# Altium project girassol-projeto.PrjPCB
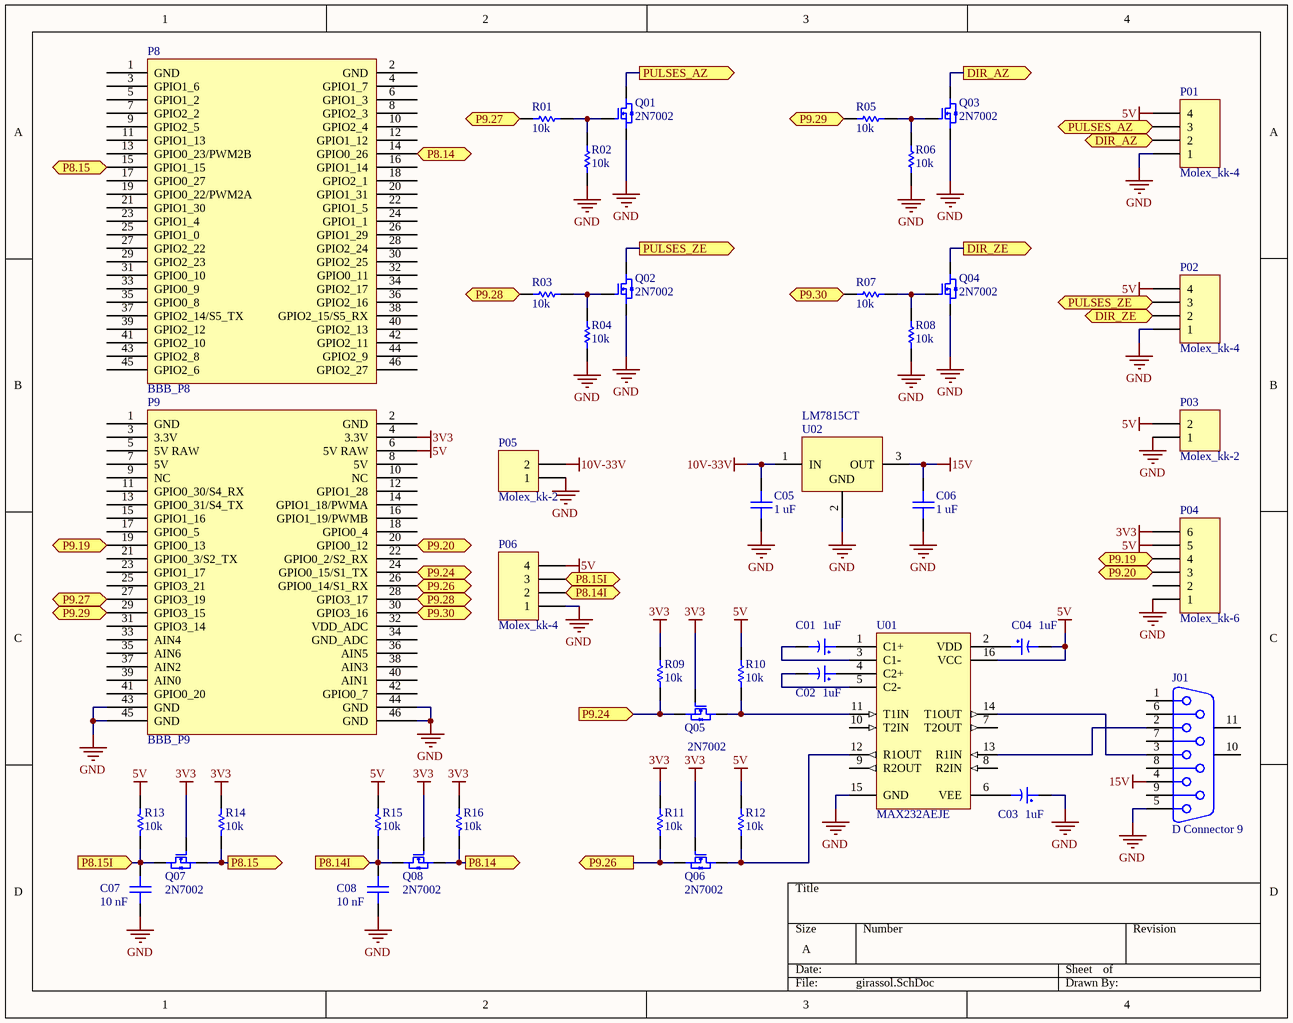
[diagram p0: girassol.SchDoc]
1 sheet, 43 parts. Net scope: flat (ports and power ports of the same name join across sheets).
Board files: girassol2.PcbDoc, girassol3.PcbDoc, PCB1.PcbDoc

## Sheet girassol.SchDoc
size A

### Parts
C01  1uF  [CP-RAD-6.3mm-15.0mm-2.5mm]
C02  1uF  [CP-RAD-6.3mm-15.0mm-2.5mm]
C03  1uF  [CP-RAD-6.3mm-15.0mm-2.5mm]
C04  1uF  [CP-RAD-6.3mm-15.0mm-2.5mm]
C05  1 uF  [0805SMD]
C06  1 uF  [0805SMD]
C07  10 nF  [0805SMD]
C08  10 nF  [0805SMD]
J01  D Connector 9  [DSUB1.385-2H9]
P01  Molex_kk-4  [Molex_kk-4]
P02  Molex_kk-4  [Molex_kk-4]
P03  Molex_kk-2  [Molex_kk-2]
P04  Molex_kk-6  [Molex_kk-6]
P05  Molex_kk-2  [Molex_kk-2]
P06  Molex_kk-4  [Molex_kk-4]
P8  BBB_P8  [BBB_CAPE_HEADER]
P9  BBB_P9  [BBB_CAPE_HEADER]
Q01  2N7002  [SOT-23/3]
Q02  2N7002  [SOT-23/3]
Q03  2N7002  [SOT-23/3]
Q04  2N7002  [SOT-23/3]
Q05  2N7002  [SOT-23/3]
Q06  2N7002  [SOT-23/3]
Q07  2N7002  [SOT-23/3]
Q08  2N7002  [SOT-23/3]
R01  10k  [1206SMD]
R02  10k  [1206SMD]
R03  10k  [1206SMD]
R04  10k  [1206SMD]
R05  10k  [1206SMD]
R06  10k  [1206SMD]
R07  10k  [1206SMD]
R08  10k  [1206SMD]
R09  10k  [1206SMD]
R10  10k  [1206SMD]
R11  10k  [1206SMD]
R12  10k  [1206SMD]
R13  10k  [1206SMD]
R14  10k  [1206SMD]
R15  10k  [1206SMD]
R16  10k  [1206SMD]
U01  MAX232AEJE  [JE16]
U02  LM7815CT  [TO-220/123]

### Ports
DIR_AZ (in), DIR_AZ (out), DIR_ZE (in), DIR_ZE (out), P8.14 (in), P8.14 (out), P8.14I (in), P8.14I (out), P8.15 (in), P8.15 (out), P8.15I (in), P8.15I (out), P9.19 (in), P9.19 (out), P9.20 (in), P9.20 (out), P9.24 (in), P9.24 (out), P9.26 (in), P9.26 (out), P9.27 (in), P9.27 (out), P9.28 (in), P9.28 (out), P9.29 (in), P9.29 (out), P9.30 (in), P9.30 (out), PULSES_AZ (in), PULSES_AZ (out), PULSES_ZE (in), PULSES_ZE (out)

### Nets
3V3: P04.6 P9.4(3.3V) Q05.1(G) Q06.1(G) Q07.1(G) Q08.1(G) R09.2 R11.2 R14.2 R16.2
5V: C04.2 P01.4 P02.4 P03.2 P04.5 P06.4 P9.6(5V_RAW) R10.2 R12.2 R13.2 R15.2 U01.16(VCC)
10V-33V: C05.2 P05.2 U02.1(IN)
15V: C06.2 J01.4 U02.3(OUT)
GND: C03.1 C05.1 C06.1 C07.1 C08.1 J01.5 P01.1 P02.1 P03.1 P04.1 P05.1 P06.1 P9.43(GND) P9.44(GND) P9.45(GND) P9.46(GND) Q01.2(S) Q02.2(S) Q03.2(S) Q04.2(S) R02.2 R04.2 R06.2 R08.2 U01.15(GND) U02.2(GND)
NetC01_1: C01.1 U01.1(C1+)
NetC01_2: C01.2 U01.3(C1-)
NetC02_1: C02.1 U01.4(C2+)
NetC02_2: C02.2 U01.5(C2-)
NetC03_2: C03.2 U01.6(VEE)
NetC04_1: C04.1 U01.2(VDD)
NetC07_2: C07.2 P06.3 Q07.3(D) R13.1 ; port P8.15I
NetC08_2: C08.2 P06.2 Q08.3(D) R15.1 ; port P8.14I
NetJ01_2: J01.2 U01.13(R1IN)
NetJ01_3: J01.3 U01.14(T1OUT)
NetP01_2: P01.2 Q03.3(D) ; port DIR_AZ
NetP01_3: P01.3 Q01.3(D) ; port PULSES_AZ
NetP02_2: P02.2 Q04.3(D) ; port DIR_ZE
NetP02_3: P02.3 Q02.3(D) ; port PULSES_ZE
NetP04_3: P04.3 P9.20(GPIO0_12) ; port P9.20
NetP04_4: P04.4 P9.19(GPIO0_13) ; port P9.19
NetP8_14: P8.14(GPIO0_26) Q08.2(S) R16.1 ; port P8.14
NetP8_15: P8.15(GPIO1_15) Q07.2(S) R14.1 ; port P8.15
NetP9_24: P9.24(GPIO0_15/S1_TX) Q05.2(S) R09.1 ; port P9.24
NetP9_26: P9.26(GPIO0_14/S1_RX) Q06.2(S) R11.1 ; port P9.26
NetP9_27: P9.27(GPIO3_19) R01.1 ; port P9.27
NetP9_28: P9.28(GPIO3_17) R03.1 ; port P9.28
NetP9_29: P9.29(GPIO3_15) R05.1 ; port P9.29
NetP9_30: P9.30(GPIO3_16) R07.1 ; port P9.30
NetQ01_1: Q01.1(G) R01.2 R02.1
NetQ02_1: Q02.1(G) R03.2 R04.1
NetQ03_1: Q03.1(G) R05.2 R06.1
NetQ04_1: Q04.1(G) R07.2 R08.1
NetQ05_3: Q05.3(D) R10.1 U01.11(T1IN)
NetQ06_3: Q06.3(D) R12.1 U01.12(R1OUT)

Not connected (* = marked no-connect by the designer): J01 1 6 7 8 9 10(MH1) 11(MH2); P04 2; P8 1(GND) 2(GND) 3(GPIO1_6) 4(GPIO1_7) 5(GPIO1_2) 6(GPIO1_3) 7(GPIO2_2) 8(GPIO2_3) 9(GPIO2_5) 10(GPIO2_4) 11(GPIO1_13) 12(GPIO1_12) 13(GPIO0_23/PWM2B) 16(GPIO1_14) 17(GPIO0_27) 18(GPIO2_1) 19(GPIO0_22/PWM2A) 20(GPIO1_31) 21(GPIO1_30) 22(GPIO1_5) 23(GPIO1_4) 24(GPIO1_1) 25(GPIO1_0) 26(GPIO1_29) 27(GPIO2_22) 28(GPIO2_24) 29(GPIO2_23) 30(GPIO2_25) 31(GPIO0_10) 32(GPIO0_11) 33(GPIO0_9) 34(GPIO2_17) 35(GPIO0_8) 36(GPIO2_16) 37(GPIO2_14/S5_TX) 38(GPIO2_15/S5_RX) 39(GPIO2_12) 40(GPIO2_13) 41(GPIO2_10) 42(GPIO2_11) 43(GPIO2_8) 44(GPIO2_9) 45(GPIO2_6) 46(GPIO2_27); P9 1(GND) 2(GND) 3(3.3V) 5(5V_RAW) 7(5V) 8(5V) 9(NC) 10(NC) 11(GPIO0_30/S4_RX) 12(GPIO1_28) 13(GPIO0_31/S4_TX) 14(GPIO1_18/PWMA) 15(GPIO1_16) 16(GPIO1_19/PWMB) 17(GPIO0_5) 18(GPIO0_4) 21(GPIO0_3/S2_TX) 22(GPIO0_2/S2_RX) 23(GPIO1_17) 25(GPIO3_21) 31(GPIO3_14) 32(VDD_ADC) 33(AIN4) 34(GND_ADC) 35(AIN6) 36(AIN5) 37(AIN2) 38(AIN3) 39(AIN0) 40(AIN1) 41(GPIO0_20) 42(GPIO0_7); U01 7(T2OUT) 8(R2IN) 9(R2OUT) 10(T2IN)

### Library data of the parts
C01 C02 C03 C04 = Capacitor-Electrolytic: Electrolytic Capacitor; Voltage: 25 V
C05 C06 C07 C08 = Capacitor
J01 = D Connector 9: Receptacle Assembly, 9 Position, Right Angle; PackageDocument: O; Positions: 9; Published: 15-Jun-2001; LatestRevisionDate: 17-Jul-2002; LatestRevisionNote: Re-released for DXP Platform.; DatasheetDocument: 1-Sep-1999; PackageReference: 788750; Publisher: Altium Limited; Orientation: Right Angle; Gender: Receptacle
R01 R02 R03 R04 R05 R06 R07 R08 R09-R16 = Resistor: Tolerance: 5%; Power: 1/4 W; Published: 8-Jun-2000; LatestRevisionDate: 17-Jul-2002; LatestRevisionNote: Re-released for DXP Platform.; PackageReference: AXIAL-0.3; Publisher: Altium Limited
U01 = MAX232AEJE: +5V Powered, Multi-Channel RS-232 Driver/Receiver; Published: 16-Jan-2001; LatestRevisionDate: 29-May-2009; LatestRevisionNote: Component Body Added.; PackageVersion: 1996; PackageReference: JE16; Publisher: Altium Limited; PackageDescription: DIP, 16-Pin, Row Spacing 7.62 mm, Pitch 2.54 mm; ComponentLink1Description: Manufacturer Link; ComponentLink1URL: http://www.maxim-ic.com/; ComponentLink2Description: Datasheet; ComponentLink2URL: http://pdfserv.maxim-ic.com/en/ds/MAX220-MAX249.pdf
U02 = LM7815CT: Positive 15 V Regulator; Manufacturer: Fairchild Semiconductor; Regulator Topology: Positive Fixed; Voltage - Output: 15V; Current - Output: 1A; Voltage - Dropout (Typical): 2V @ 1A; Number of Regulators: 1; Voltage - Input: Up to 35V; Supplier 1: Digi-Key; Supplier Part Number 1: LM7815CTFS-ND; Manufacturer Part Number: LM7815CT; RoHS: RoHS Compliant; Category: Integrated Circuits (ICs); Stock 1: 1594; Pricing 1: 1=0.7, 10=0.588, 25=0.5144, 100=0.441, 250=0.3822, 500=0.3234, 1000=0.2499, 2500=0.22785, 5000=0.21315 (USD); Packaging: Tube; Current - Limit (Min): -; Operating Temperature: -40°C ~ 125°C; Mounting Type: Through Hole; Package / Case: TO-220-3; Supplier Device Package: TO-220-3; ComponentLink1URL: http://www.fairchildsemi.com/datasheets/LM/LM7805.pdf; ComponentLink1Description: http://www.fairchildsemi.com/datasheets/LM/LM7805.pdf